# Altium schematic sheet Sheet1.SchDoc
size A0; SheetNumber: 1; SheetTotal: 1
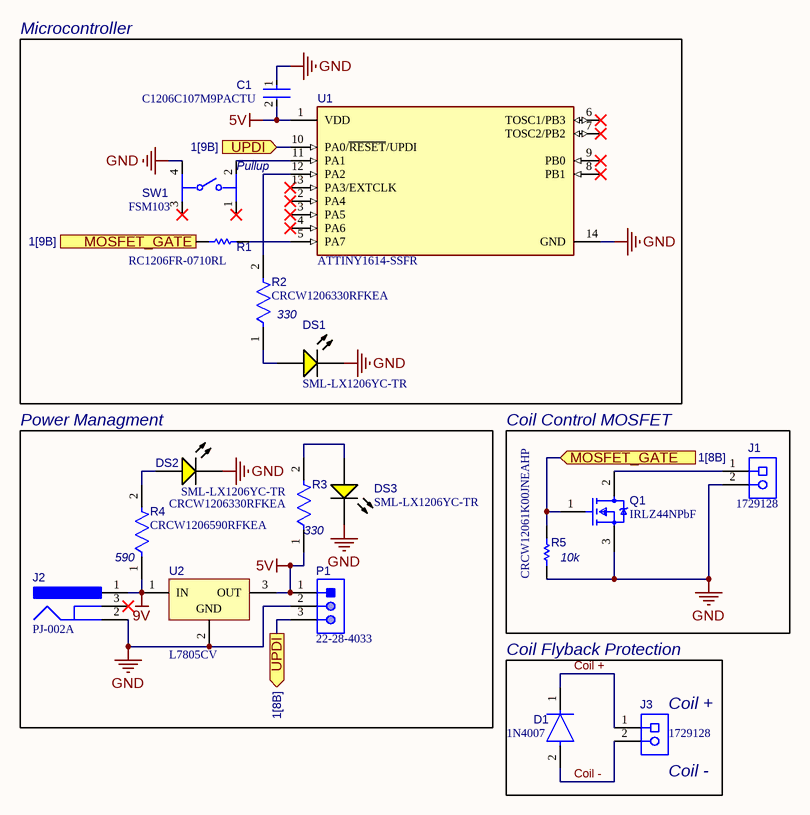
[diagram p0: Sheet1.SchDoc]

## Parts
C1  C1206C107M9PACTU  [FP-C1206C-EH-MFG]
D1  1N4007  [FP-1N4007-MFG]
DS1  SML-LX1206YC-TR  [LUMX-SML-LX1206YC-TR_V]
DS2  SML-LX1206YC-TR  [LUMX-SML-LX1206YC-TR_V]
DS3  SML-LX1206YC-TR  [LUMX-SML-LX1206YC-TR_V]
J1  1729128  [PHOE-1729128-2_V]
J2  PJ-002A  [CUI-PJ-002A_V]
J3  1729128  [PHOE-1729128-2_V]
P1  22-28-4033  [MOLX-22-28-4033_V]
Q1  IRLZ44NPbF  [FP-PG-TO220-3-MFG]
R1  RC1206FR-0710RL  [RESC3116X65X40ML10T20]
R2  CRCW1206330RFKEA  [FP-CRCW1206-e3-IPC_A]
R3  CRCW1206330RFKEA  [FP-CRCW1206-e3-IPC_A]
R4  CRCW1206590RFKEA  [FP-CRCW1206-e3-MFG]
R5  CRCW12061K00JNEAHP  [RESC3116X65X50LL20T20]
SW1  FSM103  [FP-FSM103-MFG]
U1  ATTINY1614-SSFR  [FP-C04-065-D3X-MFG]
U2  L7805CV  [TO220]

## Blocks framed on the sheet
Microcontroller: C1 DS1 R1 R2 SW1 U1
Power Managment: DS2 DS3 J2 P1 R3 R4 U2
Coil Control MOSFET: J1 Q1 R5

## Ports
MOSFET_GATE (in, see 1[8B]), MOSFET_GATE (out, see 1[9B]), UPDI (in, see 1[9B]), UPDI (out, see 1[8B])

## Nets
5V: C1.2 P1.1 R3.1 U1.1(VDD) U2.3(OUT)
9V: J2.1 R4.1 U2.1(IN)
GND: C1.1 DS1.2(K) DS2.2(K) DS3.2(K) J1.2 J2.2 P1.2 Q1.3(S) R5.1 SW1.4 U1.14(GND) U2.2(GND)
Coil +: D1.1(C) J3.1
Coil -: D1.2(A) J3.2
MOSFET_GATE: Q1.1(G) R1.1 R5.2 ; port MOSFET_GATE
UPDI: P1.3 U1.10(PA0/~{RESET}/UPDI) ; port UPDI
NetDS1_1: DS1.1(A) R2.1
NetDS2_1: DS2.1(A) R4.2
NetDS3_1: DS3.1(A) R3.2
NetJ1_1: J1.1 Q1.2(D)
NetR1_2: R1.2 U1.5(PA7)
NetR2_2: R2.2 U1.12(PA2)
NetSW1_2: SW1.2 U1.11(PA1)

Not connected (* = marked no-connect by the designer): J2 3*; SW1 1* 3*; U1 2(PA4)* 3(PA5)* 4(PA6)* 6(TOSC1/PB3)* 7(TOSC2/PB2)* 8(PB1)* 9(PB0)* 13(PA3/EXTCLK)*

## Notes on the sheet
- (near SW1) Pullup
- (near R2) 330
- (near R4) 590
- (near R3) 330
- (near R5) 10k
- Coil Flyback Protection
- (near J3) Coil +
- (near J3) Coil -

## Library data of the parts
C1 = CMP-1037-05005-3: CAP CER 100UF 6.3V X5R 1206; Dielectric Material: Ceramic; Tolerance: 2%; Dissipation Factor: 5%; Min Operating Temperature: -55°C; Case Code (Imperial): 1206; Case Code (Metric): 3216; Depth: 1.6mm; Dielectric: X5R; Max Operating Temperature: 85°C; Packaging: Tape and Reel; Construction: Flat; Series: C; Case/Package: 1206; Radiation Hardening: No; Voltage Rating (DC): 6.3V; Termination: SMD/SMT; Voltage Rating: 6.3V; Capacitance: 100uF; Number of Pins: 2; RoHS Compliant: Yes; Height: 1.6mm; Lead Free: Lead Free; Voltage: 6.3V; REACH SVHC: No SVHC; Length: 3.2mm; Mount: Surface Mount; Package Quantity: 1; Thickness: 0.071inch; Width: 0.063inch
D1 = CMP-123542-000001-1: Rectifier diode 1000 V 1 A DO-41, ,; Manufacturer: Diotec; Max Surge Forward Current: 27A; Forward Current: 1A; Max Junction Temp: +175°C; Reverse Voltage: 1000V; Value: 15pF; Peak Reverse Current: 5uA; Category: Diode; Temperature Range Low: -50°C; Automotive: No; Temperature: -50°C to +175°C; Lead Free: Yes; ComponentLink2Description: Datasheet; Max Repetitive Reverse Voltage: 1000V; ComponentLink2URL: https://datasheet.octopart.com/1N4007-Diotec-datasheet-62346875.pdf; Manufacturer Part Number: 1N4007; Device Class L3: Rectifier Diodes; Height: 2.8mm; Octopart: https://octopart.com/1n4007-diotec-4040411; Package: 1N4007; Temperature Range High: +175°C; Device Class L1: Discrete Semiconductors; Device Class L2: Diodes; RoHS: TRUE; Capacitance: 15pF; Ipc Land Pattern Name: DIOAD888W100L520D280
DS1-DS3 = CMP-2000-07124-1: Yellow LED, Water Clear Len, 585 nm, 2.1 V, -40 to 85 degC, 2-Pin SMD, RoHS, Tape and Reel; Manufacturer: Lumex; Product Training Modules: LEDsBenefitsofCustomLEDandLCDTechnology; Millicandela Rating: 6mcd; Catalog Drawings: SML-LX1206SeriesTopSML-LX1206SeriesSideSML-LX1206SeriesBottomSML-LX1206SeriesFootprint; Wavelength - Peak: 585nm; Other Names: 67-1358-2LU60357TRSMLLX1206YCTR; Lens Style/Size: RectanglewithFlatTop; Current - Test: 20mA; Lens Color: Colorless; Viewing Angle: 160°; Voltage - Forward (Vf) (Typ): 2.1V; Online Catalog: SML-LX1206RectanglewithFlatTop1206PackageLEDs; Mounting Type: SurfaceMount; Package Description: 2-Pin Surface Mount Device, Body 3.2 x 1.5 mm; Datasheet Version: Rev. K, 08/2012; Features: -; Color: Yellow; RoHS Information: RoHSCertofCompliance; Package Reference: SML-LX1206YC-TR; Supplier Device Package: 1206; Standard Package: 3,000; Series: -; Wavelength - Dominant: -; Package / Case: 1206(3216Metric); Mounting Technology: SurfaceMount; Height (Max): 1.10mm; Lens Transparency: Clear; Datasheet URL: http://www.lumex.com/content/files/ProductAttachment/SML-LX1206YC-TR.pdf; Family: LEDIndication-Discrete; Manufacturer URL: http://www.lumexinstruments.com/; Packaging: Tape&Reel(TR); Category: Optoelectronics; Size / Dimension: 3.20mmLx1.60mmW
J1 J3 = CMP-2000-05815-1: PCB Terminal Block, 13.5 A, 400 V, 2-Pin THD, RoHS, Bulk; Manufacturer: Phoenix Contact; Package Version: 03/2015; No. of Rows: 1; Pitch: 5.08mm; No. of Positions: 2; Voltage Rating: 400V; Current Rating: 13500mA; Manufacturer URL: http://www.phoenixcontact.com/; Datasheet URL: https://datasheet.ciiva.com/16046/1729128-16046181.pdf; RoHS: TRUE; Package URL: https://www.phoenixcontact.com/online/portal/pi/pxc/product_detail_page/!ut/p/b1/3VdJjqNKFDxLH8AFycySyWY2ozFsEPOMMQaDOX1XedGL_1Vdm5YXJleknhSKeBkvI6EA8ncAo3AYoDhBQGco6KN7VURTdemj9us_IEKEZo_YHiPAEWEFmDGOHMORkqKYCORBZxgL7ZoaZYcbFFUZ3fqxSY6GOuxydWUuHqz1ynmMFygu583Bob0Ewr6Sd_l-5m-kAueHiB0jpRwZwe58wwtkpxtMYd_LmGcDRU02dRNEyWt6Y2ti5pSyJ_reIkzIulrqApdnbT11V5jnCKbYNCvhEM1MCpPByat_X379-iThf08CI5GfOPqfBeS3BRoBOdD55AKVv0iLwCMq-2BrzXWSGRH7pUGD9uwXQjiph3xL0DKQwdGa0JImiIOmBNOestqgwTHSSs2oOep-78apyXQBvNi8ZLaFjvjWvcaUEBu0MC6Wbe-d6mB0FAebo2lUWinqYaZs5DAYzV0RP9yitUjnGJ0iI9xhZkT42OCQNUJJhkgWINNQLP2JFP6OpMg3JCVg70jqHT0lvKOnhHf0lPuOnnLf0VPuWx6_dxwUIvwk5WMkT0kLL1mh61l2yZVSzG3pYV_bqo-mj6uMKwKwdnnW8Jh5RTOJzMOA5c-eJDaZQw4mTMPH02PvS_ZAqNVjVTo2WyYLkwH_KU1mmmG5kjRhDqPXLwwVHvVOjCM60-fpXvTDfMGW1PVFVS1r4e4yVDk4ZdNbkUHvqPqQSeian4UD39fNKmachqdJ1NJbyk8rXT9mXTvPk3oE5meulKGgiruPJek-4I9hTT6G8ZLOyRSm2RRVbThERQad5OS28hdt4YW4vG0stgYYzsWsK4_7y6DZMjJSCqri1kyiZR5vD7pwIrNR7QwPHTcLTI5qT7eRlpHrdGiupYlqQDJ7zy_CND8fWWBoLRXxk1RVcXiBQwbTD4Xi7KL-FuO94t9xaqweXzH; PartNumber: 1729128; Package Description: 2-Pin Through Hole Device, Body 8.1 x 10.16 mm, Pitch 5.08 mm; Datasheet Version: 12/2013; Mounting Technology: ThroughHole; Orientation: Horizontal; Package Reference: 1729128-2; Packing: Bulk
J2 = CMP-2000-06895-2: Through Hole Right Angle DC Power Jack, 2.5 A, 2 mm Center Pin, 3 Position, -25 to 85 degC, RoHS, Bulk; Manufacturer: CUIInc.; Brand: CUI; Inside Contact Diameter: 2mm; Voltage Rating: 24V; Outside Contact Diameter: 6.5mm; Current Rating: 2.5A; Insulation Resistance: 50MOhms; Contact Gender: Male; Connector Type: DCPowerJack; Datasheet Version: Rev. 1.03, 04/2016; Housing Material: PolybutyleneTerephthalate(PBT); Operating Temperature Range: -25Cto+85C; Termination Style: ThroughHole; Product Category: DCPowerConnectors; Mounting Technology: ThroughHole; Mounting Style: ThroughHole; Factory Pack Quantity: 500; Contact Plating: Nickel; Package Reference: PJ-002A; Mounting Angle: Right; Package Description: 3-Pin Through Hole Device, Body 14.4 x 9 mm, Height 11 mm; Flammability Rating: UL94V-0; Manufacturer URL: http://www.cui.com/; Product: Jacks; Contact Material: Copper; Datasheet URL: http://www.cui.com/product/resource/pj-002a.pdf; RoHS: True
P1 = CMP-1676-00001-5: Male Header, Pitch 2.54 mm, 1 x 3 Position, Height 8.38 mm, Tail Length 3.18 mm, RoHS, Bulk; Manufacturer: Molex; Rows: 1; Voltage Rating: 250 V; Current Rating: 4 A; Min Operating Temperature: 0 degC; Lead Pitch: 0.1 inch; Packaging: Bulk; Contact Finish: Gold; RoHSCompliant: true; Contact Material: Brass; PackageReference: 22-28-4033; REACH SVHC: Unknown; PackageDescription: Male Header, Pitch 2.54 mm, 1 x 3 Position, Height 8.38 mm, Tail Length 3.18 mm; ComponentLink2URL: http://www.molex.com/pdm_docs/sd/022284033_sd.pdf; Height: 8.38 mm; Mounting Technology: Through Hole; ComponentLink1Description: Manufacturer URL; Length: 7.62 mm; Mount: Through Hole; DatasheetVersion: Rev. G, 01/2012; Max Operating Temperature: 75 degC; ComponentLink2Description: Datasheet; Colour: Black; Pins: 3; Contact Plating: Gold; Package Quantity: 1; ComponentLink1URL: http://www.molex.com/
Q1 = CMP-32901-000488-1: MOSFET N-CH 55V 47A TO220AB; Turn-On Delay Time: 11ns; Gate to Source Voltage (Vgs): 16V; Element Configuration: Single; Rds On Max: 22mR; Turn-Off Delay Time: 26ns; Max Power Dissipation: 110W; Threshold Voltage: 2V; Drain to Source Resistance: 35mR; Input Capacitance: 1.7nF; Continuous Drain Current (ID): 47A; Case/Package: TO-220; Lead Free: Lead Free; Halogen Free: Halogen Free; Packaging: Rail/Tube; Length: 0.414inch; Min Operating Temperature: -55°C; REACH SVHC: No SVHC; Number of Pins: 3; Width: 0.185inch; Drain to Source Voltage (Vdss): 55V; Power Dissipation: 110W; RoHS Compliant: Yes; Max Operating Temperature: 175°C; Height: 0.6inch; Max Dual Supply Voltage: 55V; Drain to Source Breakdown Voltage: 55V; Mount: Through Hole
R1 = CMP-2100-03677-1: Chip Resistor, 10 Ohm, +/- 1%, 0.25 W, -55 to 155 degC, 1206 (3216 Metric), RoHS, Tape and Reel; Manufacturer: Yageo; Voltage Rating (DC): 200V; Resistance: 10Ohm; Power Rating: 250mW; Temperature Coefficient: 200ppm/degreesC; Military Standard: Not; Package Description: 2-Pin Surface Mount Device, Body 3.1 x 1.6 mm; Packaging: TapeandReel; Datasheet Version: Rev. 5, 10/2016; Length: 3.1mm; Manufacturer URL: http://www.yageo.com/; Voltage Rating: 200V; Height: 0.026inch; REACH SVHC: Unknown; Max Operating Temperature: 155degC; Case Code (Imperial): 1206; Package Reference: 1206.0; RoHSCompliant: true; Termination: SMD/SMT; Lead Free: LeadFree; Composition: ThickFilm; Tolerance: 1%; Package Quantity: 1; Min Operating Temperature: -55degC; Datasheet URL: http://www.yageo.com/NewPortal/yageodocoutput?fileName=/pdf/R-Chip/PYu-RC_Group_51_RoHS_L_5.pdf; Number of Pins: 2; Width: 0.063inch; Case Code (Metric): 3216; Max Power Dissipation: 250mW; Depth: 1.6mm; Number of Terminations: 2; Case/Package: 1206
R2 R3 = CMP-2003-02098-2: RES Thick Film, 330Ω, 1%, 0.25W, 100ppm/°C, 1206; Voltage Rating: 200V; Resistance: 330R; Max Power Dissipation: 250mW; Height: 0.55mm; Mount: Surface Mount; Min Operating Temperature: -55°C; Depth: 1.6mm; Features: Automotive AEC-Q200; Voltage Rating (DC): 200V; Military Standard: Not; Packaging: Tape and Reel; Composition: Thick Film; Contact Plating: Tin; Case Code (Imperial): 1206; Case/Package: 1206; Number of Terminations: 2; Length: 3.2mm; Lead Free: Lead Free; Tolerance: 1%; Temperature Coefficient: 100ppm/°C; Case Code (Metric): 3216; Width: 1.6mm; Weight: 0.000353oz; Termination: SMD/SMT; Radiation Hardening: No; Package Quantity: 10; Power Rating: 250mW; Max Operating Temperature: 155°C
R4 = CMP-2003-02292-2: RES Thick Film, 590Ω, 1%, 0.25W, 100ppm/°C, 1206; Max Power Dissipation: 250mW; Voltage Rating: 200V; Resistance: 590R; Max Operating Temperature: 155°C; Number of Pins: 2; Case Code (Imperial): 1206; Power Rating: 250mW; Composition: Thick Film; Tolerance: 1%; Voltage Rating (DC): 200V; Length: 3.2mm; Packaging: Tape and Reel; Termination: SMD/SMT; Lead Free: Lead Free; Military Standard: Not; Features: Automotive AEC-Q200; Weight: 0.000353oz; Width: 0.063inch; Height: 0.024inch; Case Code (Metric): 3216; Temperature Coefficient: 100ppm/°C; Case/Package: 1206; Package Quantity: 10; Number of Terminations: 2; Contact Plating: Tin; Radiation Hardening: No; Depth: 1.6mm; Min Operating Temperature: -55°C
R5 = CMP-2003-04880-1: Manufacturer: Vishay Dale; Part Number: CRCW12061K00JNEAHP
SW1 = CMP-03407-000037-1: SWITCH TACTILE SPST-NO 0.05A 24V; Contact Resistance: 100mR; Actuator Length: 3.4mm; Switch Function: Off-Mom; Operating Force: 1.57N; Illumination Type: Non-Illuminated; Voltage Rating (DC): 12V; Current Rating: 50mA; Actuator Material: Polyester; Switch Travel: 0.3mm; Throw Configuration: SPST; Actuator Color: Black; Mechanical Life: 100000Cycles; Depth: 14.1mm; RoHS Compliant: Yes; Max Operating Temperature: 85°C; Mount: Through Hole; Min Operating Temperature: -35°C; Contact Plating: Silver; Width: 12mm; Package Quantity: 400; Radiation Hardening: No; Series: FSM100 ~ 104; Type: Switch; Termination: PC Pins; Voltage Rating: 24V; Contact Material: Brass; Max Voltage Rating (DC): 12V; Contact Current Rating: 50mA; Length: 12mm; Packaging: Loose Piece; Orientation: Straight; Max Current Rating: 50mA; Electrical Life: 100000Cycles
U1 = CMP-06276-000021-1: IC MCU 8BIT 16KB FLASH 14SOIC; Manufacturer: Microchip; Number Of A/D Converters: 2; Number Of Uart Channels: 1; Min Supply Voltage: 1.8V; Interface: I2C,SPI,UART,USART,2-Wire,LIN,IrDA; Memory Size: 16KBytes; Core Architecture: AVR; Nominal Supply Current: 2.6-10200uA; Data Bus Width: 8bits; Max Supply Voltage: 5.5V; Number Of I/Os: 12; Standoff Height: 0.1mm; Number Of Adc Channels: 14; Ram Size: 2KBytes; Number Of Timers/Counters: 5; Frequency: 16MHz; Temperature Range High: +125°C; Device Class L3: Microcontrollers; Number Of Cores: 1; Temperature Range Low: -40°C; Ipc Land Pattern Name: SOIC127P600X175-14; Height: 1.75mm; Category: IC; Number Of Pwm Channels: 1; Manufacturer Part Number: ATTINY1614-SSFR; Device Class L2: Embedded Processors and Controllers; ComponentLink2Description: Datasheet; Device Class L1: Integrated Circuits (ICs); Number Of Spi Channels: 1; Lead Free: Yes; Digikey Description: IC MCU 8BIT 16KB FLASH 14SOIC; Number Of I2C Channels: 1; Memory Type: FLASH; ComponentLink2URL: http://ww1.microchip.com/downloads/en/DeviceDoc/ATtiny1614-DataSheet-DS40001995B.pdf; RoHS: TRUE; Package: C04-065-D3X; Temperature: -40°C to +125°C; Mouser Description: 8-Bit AVR Microcontroller 16Kbyte Flash 2Kbyte SRAM 14-Pin SOIC T/R; Automotive: No; Octopart: https://octopart.com/attiny1614-ssfr-microchip-82181131
U2 = CMP-0244-00483-1: Positive Voltage Regulator, 5V, 3-Pin TO-220; PackageDescription: TO, Thru-Hole, Vertical, Heatsink Mounted; 3 In-Line Leads; Pitch 2.54 mm; ComponentLink2Description: Datasheet; PackageReference: TO220; ComponentLink3URL: http://www.st.com/internet/com/TECHNICAL_RESOURCES/TECHNICAL_LITERATURE/PACKAGE_INFORMATION/CD00004649.pdf; DatasheetVersion: 16/11/2011; ComponentLink1Description: Manufacturer URL; ComponentLink1URL: http://www.st.com; PackageVersion: ver3.0; ComponentLink3Description: Package Specification; ComponentLink2URL: http://www.st.com/internet/com/TECHNICAL_RESOURCES/TECHNICAL_LITERATURE/DATASHEET/CD00000444.pdf